# EAGLE board x9303 (EAGLE 9.6.2)
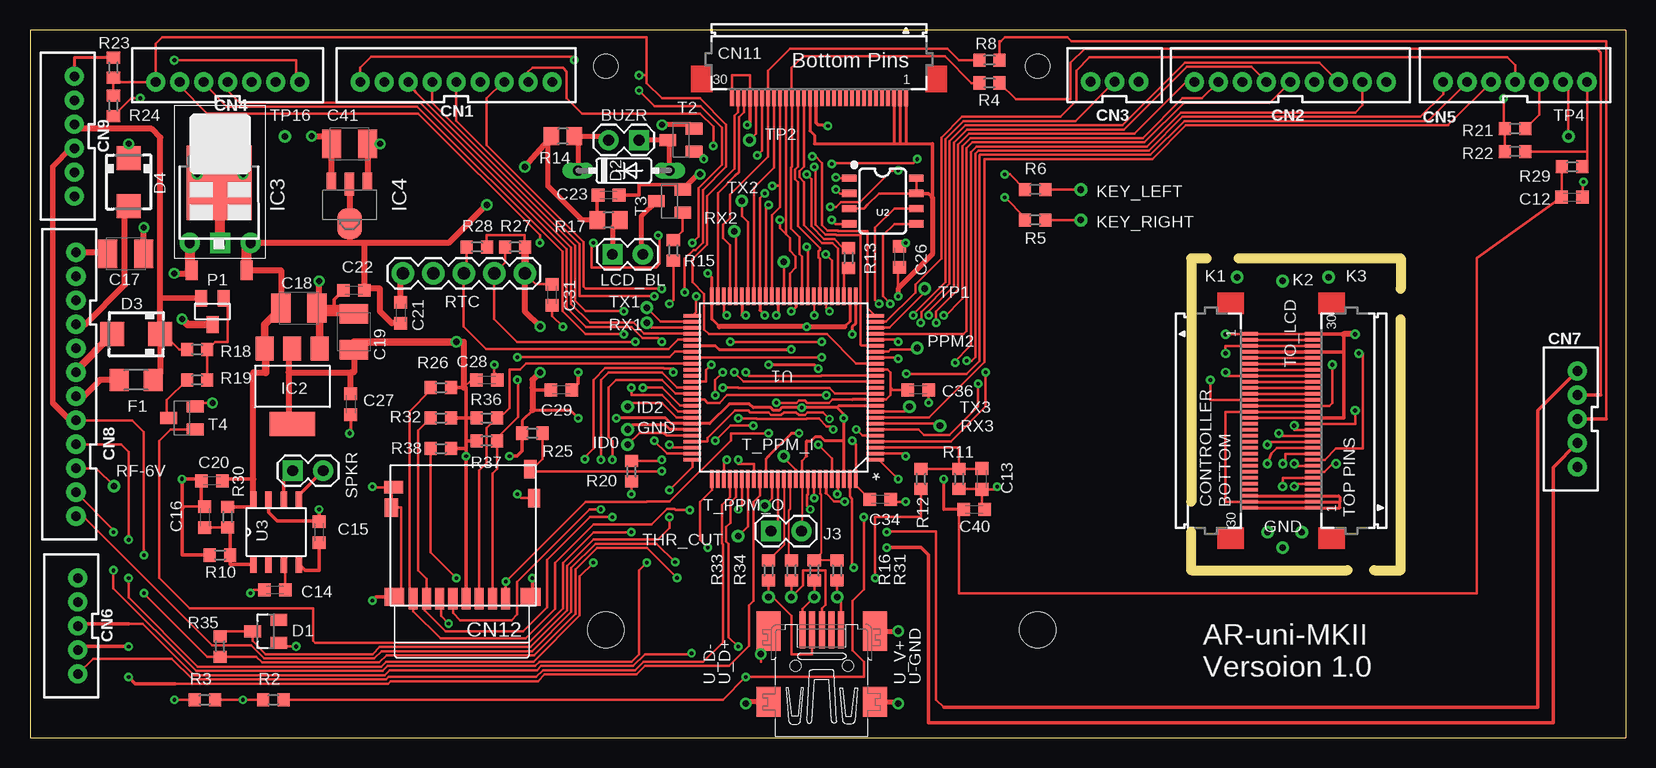
[diagram p3: board, top side]
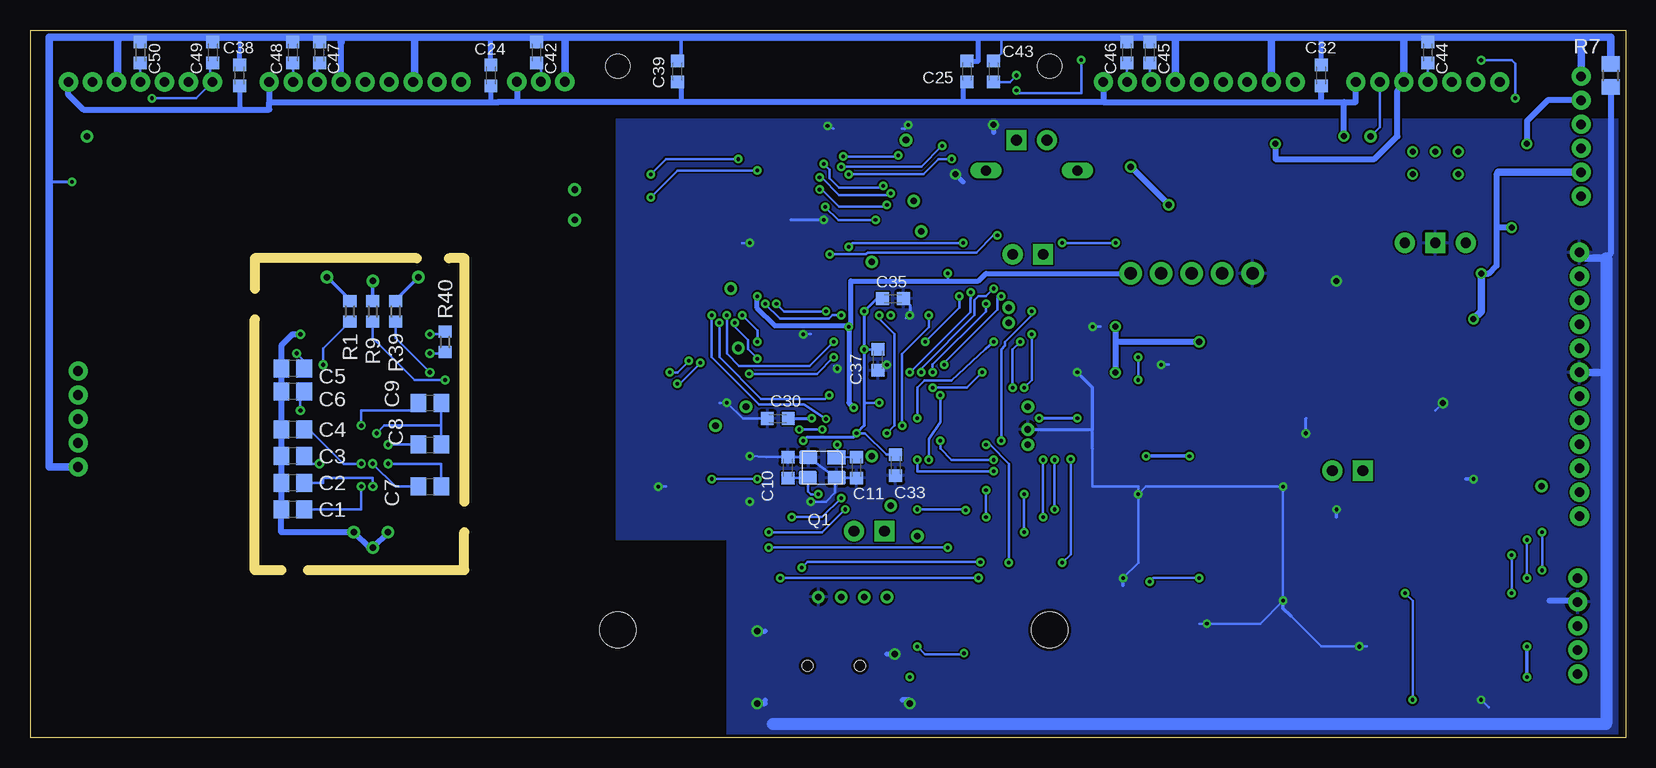
[diagram p4: board, bottom side, seen from below]

Size 133 x 59 mm. Coordinates in mm from the lower left corner, seen from the top.
Copper layers (1*16): Top 0.035mm / dielectric 1.5mm / Bottom 0.035mm
Design rules "default *": minimum track width 6mil, minimum drill 0.3mm, track to track 6mil, track to pad 6mil, pad to pad 6mil, via to via 6mil, smd to smd 6mil, copper to edge 10mil, drill to drill 6mil, minimum pad ring 10mil, minimum via ring 8mil, stop-mask expansion 4mil, vias tented up to drill 0mil, thermal gap 10mil
tKeepout: area 82,7 to 86,11; area 46,7 to 50,11; area 46,54 to 50,58; area 82,54 to 86,58
Milling: 8 lines

## Footprints (pad centres in the part's own frame; a part is rotated, then mirrored left to right if it is on the bottom)
1X02 = drill 0.9 pad 1.676 square: 1 -1.27,0 | drill 0.9 pad 1.676: 2 1.27,0
C0805 = smd 1.3 x 1.5: 1 -0.95,0; 2 0.95,0
C0603K = smd 1.05 x 1.08: 1 -0.875,0; 2 0.875,0
SMC_B = smd 1.6 x 2.4: + -1.5,0; - 1.5,0
JST-9-PTH-VERT = drill 0.8 pad 1.6: 1 -8,-1.82; 2 -6,-1.82; 3 -4,-1.82; 4 -2,-1.82; 5 0,-1.82; 6 2,-1.82; 7 4,-1.82; 8 6,-1.82; 9 8,-1.82
JST-3-PTH-VERT = drill 0.8 pad 1.6: 1 -2,-0.55; 2 0,-0.55; 3 2,-0.55
JST-7-PTH-VERT = drill 0.8 pad 1.6: 1 -6,-1.82; 2 -4,-1.82; 3 -2,-1.82; 4 0,-1.82; 5 2,-1.82; 6 4,-1.82; 7 6,-1.82
JST-5-PTH-VERT = drill 0.8 pad 1.6: 1 -4,0.18; 2 -2,0.18; 3 0,0.18; 4 2,0.18; 5 4,0.18
JST-12-PTH-VERT = drill 0.8 pad 1.6: 1 -12,-3.55; 2 -10,-3.55; 3 -8,-3.55; 4 -6,-3.55; 5 -4,-3.55; 6 -2,-3.55; 7 0,-3.55; 8 2,-3.55; 9 4,-3.55; 10 6,-3.55; 11 8,-3.55; 12 10,-3.55
JST-6-PTH-VERT = drill 0.8 pad 1.6: 1 -5,-1.82; 2 -3,-1.82; 3 -1,-1.82; 4 1,-1.82; 5 3,-1.82; 6 5,-1.82
FH12-30S-0.5SH = smd 0.3 x 1.3: 1 -7.02,2.66; 2 -6.52,2.66; 3 -6.02,2.66; 4 -5.52,2.66; 5 -5.02,2.66; 6 -4.52,2.66; 7 -4.02,2.66; 8 -3.52,2.66; 9 -3.02,2.66; 10 -2.52,2.66; 11 -2.02,2.66; 12 -1.52,2.66; 13 -1.02,2.66; 14 -0.52,2.66; 15 -0.02,2.66; 16 0.48,2.66; 17 0.98,2.66; 18 1.48,2.66; 19 1.98,2.66; 20 2.48,2.66; 21 2.98,2.66; 22 3.48,2.66; 23 3.98,2.66; 24 4.48,2.66; 25 4.98,2.66; 26 5.48,2.66; 27 5.98,2.66; 28 6.48,2.66; 29 6.98,2.66; 30 7.48,2.66
CONN8_DM3D-SF_HIR = smd 0.762 x 1.803: 1 3.551,-5.271; 2 2.451,-5.271; 3 1.351,-5.271; 4 0.251,-5.271; 5 -0.849,-5.271; 6 -1.949,-5.271; 7 -3.049,-5.271; 8 -4.149,-5.271 | smd 1.549 x 1.041: 9 -5.79,4.017 | smd 1.041 x 1.549: 10 5.606,5.531 | smd 1.143 x 1.549: GND1 -5.967,2.326 | smd 1.016 x 1.549: GND2 5.914,3.117 | smd 1.651 x 1.499: GND3 -5.732,-5.118; GND4 5.625,-5.118
SOT23 = smd 1 x 1.4: 1 -0.95,-1.1; 2 0.95,-1.1; 3 0,1.1
DO35-7 = drill 0.813 long: A 3.81,0; C -3.81,0
SMA = smd 2 x 2: A 2,0; C -2,0
R1206 = smd 1.6 x 1.803: 1 -1.422,0; 2 1.422,0
TP = drill 0.55: P$1 0,0
TO252 = smd 1 x 1.6: 1 -2.28,-4.8; 2 2.28,-4.8 | smd 5.4 x 6.2: 3 0,2.5
SOT223 = smd 1.499 x 2.007: 1 -2.261,-3.15; 2 0.025,-3.15; 3 2.311,-3.15 | smd 3.81 x 2.007: 4 0,3.15
POLOLU = drill 0.85 pad 1.676: 1 -2.54,0; 3 2.54,0 | drill 0.85 pad 1.676 square: 2 0,0
SOT89 = smd 0.8 x 1.4: 1 -1.499,-1.981; 3 1.499,-1.981 | smd 0.8 x 1.9: 2 0,-1.727 | smd 2.032 x 2.54: 4 0,1.575
XTAL2.4X2.7 = smd 1.5 x 1.15: P$1 1.2,0.85; P$2 -1.15,0.85; P$3 -1.2,-0.85; P$4 1.2,-0.85
R0603 = smd 1 x 1.1: 1 -0.85,0; 2 0.85,0
R0805 = smd 1.3 x 1.5: 1 -0.95,0; 2 0.95,0
1X05 = drill 1.016 pad 1.88: 1 0,0; 2 2.54,0; 3 5.08,0; 4 7.62,0; 5 10.16,0
SOT23-BEC = smd 1 x 1.4: B -0.95,-1.1; C 0,1.1; E 0.95,-1.1
TQFP100_14X14MC_MCH = smd 1.473 x 0.279: 1 -7.62,6; 2 -7.62,5.5; 3 -7.62,5; 4 -7.62,4.5; 5 -7.62,4; 6 -7.62,3.5; 7 -7.62,3; 8 -7.62,2.5; 9 -7.62,2; 10 -7.62,1.5; 11 -7.62,1; 12 -7.62,0.5; 13 -7.62,0; 14 -7.62,-0.5; 15 -7.62,-1; 16 -7.62,-1.5; 17 -7.62,-2; 18 -7.62,-2.5; 19 -7.62,-3; 20 -7.62,-3.5; 21 -7.62,-4; 22 -7.62,-4.5; 23 -7.62,-5; 24 -7.62,-5.5; 25 -7.62,-6; 51 7.62,-6; 52 7.62,-5.5; 53 7.62,-5; 54 7.62,-4.5; 55 7.62,-4; 56 7.62,-3.5; 57 7.62,-3; 58 7.62,-2.5; 59 7.62,-2; 60 7.62,-1.5; 61 7.62,-1; 62 7.62,-0.5; 63 7.62,0; 64 7.62,0.5; 65 7.62,1; 66 7.62,1.5; 67 7.62,2; 68 7.62,2.5; 69 7.62,3; 70 7.62,3.5; 71 7.62,4; 72 7.62,4.5; 73 7.62,5; 74 7.62,5.5; 75 7.62,6 | smd 0.279 x 1.473: 26 -6,-7.62; 27 -5.5,-7.62; 28 -5,-7.62; 29 -4.5,-7.62; 30 -4,-7.62; 31 -3.5,-7.62; 32 -3,-7.62; 33 -2.5,-7.62; 34 -2,-7.62; 35 -1.5,-7.62; 36 -1,-7.62; 37 -0.5,-7.62; 38 0,-7.62; 39 0.5,-7.62; 40 1,-7.62; 41 1.5,-7.62; 42 2,-7.62; 43 2.5,-7.62; 44 3,-7.62; 45 3.5,-7.62; 46 4,-7.62; 47 4.5,-7.62; 48 5,-7.62; 49 5.5,-7.62; 50 6,-7.62; 76 6,7.62; 77 5.5,7.62; 78 5,7.62; 79 4.5,7.62; 80 4,7.62; 81 3.5,7.62; 82 3,7.62; 83 2.5,7.62; 84 2,7.62; 85 1.5,7.62; 86 1,7.62; 87 0.5,7.62; 88 0,7.62; 89 -0.5,7.62; 90 -1,7.62; 91 -1.5,7.62; 92 -2,7.62; 93 -2.5,7.62; 94 -3,7.62; 95 -3.5,7.62; 96 -4,7.62; 97 -4.5,7.62; 98 -5,7.62; 99 -5.5,7.62; 100 -6,7.62
SO08 = smd 1.2 x 0.6: 1 -2.8,1.905; 2 -2.8,0.635; 3 -2.8,-0.635; 4 -2.8,-1.905; 5 2.8,-1.905; 6 2.8,-0.635; 7 2.8,0.635; 8 2.8,1.905
SOIC_2AADCR_DIO = smd 1.422 x 0.559: 1 -2.692,1.905; 2 -2.692,0.635; 3 -2.692,-0.635; 4 -2.692,-1.905; 5 2.692,-1.905; 6 2.692,-0.635; 7 2.692,0.635; 8 2.692,1.905
XR9303-PCB_OUTLINE = hole 2: 62,56; 98,56 | hole 3: 98,9; 62,9
32005-201 = smd 3.1 x 0.5: 1_VBUS 3,1.6; 2_D- 3,0.8; 3_D+ 3,0; 4_ID 3,-0.8; 5_USB_GND 3,-1.6 | smd 2.5 x 2: M1 -3,-4.45; M2 -3,4.45 | smd 3.3 x 2: M3 2.9,4.45; M4 2.9,-4.45 | hole 0.9: 0,2.2; 0,-2.2

## Placement (x,y rotation side)
BUZR  HAPTIC  [1X02]  49.5,49.85 180 top
C1  1uF  [C0805]  111.09,19.05 180 bottom
C2  1uF  [C0805]  111.09,21.27 180 bottom
C3  1uF  [C0805]  111.09,23.5 180 bottom
C4  1uF  [C0805]  111.09,25.72 180 bottom
C5  1uF  [C0805]  111.09,30.8 180 bottom
C6  1uF  [C0805]  111.09,28.89 180 bottom
C7  1uF  [C0805]  99.67,20.95 0 bottom
C8  1uF  [C0805]  99.67,24.45 0 bottom
C9  1uF  [C0805]  99.67,27.94 0 bottom
C10  18pf  [C0603K]  69.82,22.54 270 bottom
C11  18pf  [C0603K]  64.11,22.54 90 bottom
C12  1uF  [C0603K]  128.56,45.09 0 top
C13  0.1uF  [C0603K]  79.34,21.59 90 top
C14  0.1uF  [C0603K]  20.4,12.35 0 top
C15  0.1uF  [C0603K]  24.1,17.14 270 top
C16  1uF  [C0603K]  14.57,18.41 90 top
C17  22uf/16V  [SMC_B]  7.98,40.37 180 top
C18  33uf/10V  [SMC_B]  22.42,35.84 0 top
C19  33uf/10V  [SMC_B]  27,33.87 90 top
C20  0.1uF  [C0603K]  15.16,21.43 0 top
C21  0.1uF  [C0603K]  30.91,35.45 270 top
C22  0.1uF  [C0603K]  27.01,37.32 0 top
C23  0.1uF  [C0603K]  48.23,45.26 180 top
C24  0.1uF  [C0603K]  94.58,55.24 270 bottom
C25  0.1uF  [C0603K]  54.9,55.56 270 bottom
C26  0.1uF  [C0603K]  72.47,40.11 270 top
C27  0.1uF  [C0603K]  26.74,27.81 90 top
C28  0.1uF  [C0603K]  38.07,29.84 180 top
C29  0.1uF  [C0603K]  44.29,29.02 180 top
C30  0.1uF  [C0603K]  70.67,26.62 0 bottom
C31  0.1uF  [C0603K]  43.52,36.96 90 top
C32  0.1uF  [C0603K]  25.37,55.24 270 bottom
C33  0.1uF  [C0603K]  60.84,22.74 90 bottom
C34  0.1uF  [C0603K]  70.88,19.89 180 top
C35  0.1uF  [C0603K]  61.06,36.62 180 bottom
C36  0.1uF  [C0603K]  74.06,29.02 180 top
C37  0.1uF  [C0603K]  62.33,31.52 90 bottom
C38  0.1uF  [C0603K]  115.54,55.24 270 bottom
C39  0.1uF  [C0603K]  79.03,55.56 270 bottom
C40  1uF  [C0603K]  78.71,19.05 0 top
C41  33uf/10V  [SMC_B]  26.64,49.53 0 top
C42  0.1uF  [C0603K]  90.78,57.15 270 bottom
C43  0.1uF  [C0603K]  52.67,55.56 270 bottom
C44  0.1uF  [C0603K]  16.48,57.15 270 bottom
C45  0.1uF  [C0603K]  39.66,57.15 270 bottom
C46  0.1uF  [C0603K]  41.56,57.15 270 bottom
C47  0.1uF  [C0603K]  108.87,57.15 270 bottom
C48  0.1uF  [C0603K]  111.09,57.15 270 bottom
C49  0.1uF  [C0603K]  117.76,57.15 270 bottom
C50  0.1uF  [C0603K]  123.79,57.15 270 bottom
CN1  [JST-9-PTH-VERT]  35.53,56.52 0 top
CN2  [JST-9-PTH-VERT]  105.06,56.52 0 top
CN3  [JST-3-PTH-VERT]  90.41,55.27 0 top
CN4  [JST-7-PTH-VERT]  16.48,56.52 0 top
CN5  [JST-7-PTH-VERT]  123.79,56.52 0 top
CN6  [JST-5-PTH-VERT]  4.17,9.33 90 top
CN7  [JST-5-PTH-VERT]  129.17,26.59 90 top
CN8  [JST-12-PTH-VERT]  0.29,30.48 90 top
CN9  [JST-6-PTH-VERT]  1.88,50.16 90 top
CN11  ERC12864-2  [FH12-30S-0.5SH]  66,56 180 top
CN12  SD-CARD_10P  [CONN8_DM3D-SF_HIR]  36.1,16.88 0 top
CONTROLLER  FPC30-Top_pins  [FH12-30S-0.5SH]  99.03,26.67 270 top
D1  3V  [SOT23]  19.66,8.89 90 top
D2  1N4148  [DO35-7]  49.5,47.31 0 top
D3  MURA220T3G  [SMA]  8.86,33.66 180 top
D4  MURA220T3G  [SMA]  8.23,46.35 270 top
F1  [R1206]  8.86,29.84 0 top
GND  TP-1  [TP]  49.82,25.72 0 top
IC1  7805DT  [TO252]  15.77,43.8 0 top
IC2  L1117  [SOT223]  21.88,29.31 180 top
IC3  Pololu  [POLOLU]  15.84,41.27 0 top
IC4  MCP1700T30  [SOT89]  26.64,44.45 180 top
ID0  TP-1  [TP]  49.82,24.45 180 top
ID2  TP-1  [TP]  49.82,27.62 0 top
J3  ERASE  [1X02]  63.03,17.24 0 top
K1  TP-1  [TP]  100.62,38.42 0 top
K2  TP-1  [TP]  104.43,38.1 0 top
K3  TP-1  [TP]  108.24,38.42 0 top
K_EXT4  TP-1  [TP]  103.16,17.14 0 top
K_EXT5  TP-1  [TP]  104.43,15.88 0 top
K_EXT6  TP-1  [TP]  106.02,17.14 0 top
KEY_LEFT  TP-1  [TP]  87.6,45.72 0 top
KEY_RIGHT  TP-1  [TP]  87.6,43.18 0 top
LCD_BL  LCD_BL  [1X02]  49.82,40.32 0 top
P1  SI2371  [SOT23]  15.21,35.56 180 top
PA25  TP-1  [TP]  62.83,39.69 0 top
PPM2  TP-1  [TP]  73.95,32.51 0 top
Q1  12MHZ  [XTAL2.4X2.7]  66.96,22.54 0 bottom
R1  2.7K  [R0603]  106.33,35.56 90 bottom
R2  1K  [R0603]  20.29,3.17 180 top
R3  1K  [R0603]  14.57,3.17 0 top
R4  2.7K  [R0603]  79.98,54.61 0 top
R5  2.7K  [R0603]  83.79,43.18 0 top
R6  2.7K  [R0603]  83.79,45.72 0 top
R7  0  [R0805]  1.24,55.24 90 bottom
R8  2.7K  [R0603]  79.98,56.52 0 top
R9  2.7K  [R0603]  104.43,35.56 90 bottom
R10  470K  [R0603]  15.84,15.24 0 top
R11  2.7K  [R0603]  77.44,21.59 90 top
R12  10K  [R0603]  74.27,21.59 270 top
R13  1K  [R0603]  68.23,40.01 270 top
R14  12  [R0805]  44.42,50.16 180 top
R15  1K  [R0603]  53.63,40.64 90 top
R16  33k  [R0603]  65.38,13.97 270 top
R17  150  [R0805]  48.23,43.18 180 top
R18  100K  [R0603]  13.94,32.38 180 top
R19  2.7K  [R0603]  13.94,29.84 180 top
R20  1K  [R0603]  50.14,22.23 90 top
R21  33k  [R0603]  123.79,50.8 180 top
R22  33k  [R0603]  123.79,48.9 0 top
R23  33k  [R0603]  6.95,55.88 270 top
R24  33k  [R0603]  6.95,52.7 270 top
R25  33k  [R0603]  41.88,25.4 180 top
R26  33k  [R0603]  34.26,29.21 0 top
R27  2.7K  [R0603]  40.44,40.94 0 top
R28  2.7K  [R0603]  37.26,40.94 0 top
R29  120  [R0603]  128.56,47.62 180 top
R30  10K  [R0603]  16.48,18.41 90 top
R31  47K  [R0603]  67.28,13.97 90 top
R32  33k  [R0603]  34.26,26.67 0 top
R33  120  [R0603]  61.56,13.97 270 top
R34  120  [R0603]  63.47,13.97 270 top
R35  10K  [R0603]  15.84,7.62 90 top
R36  33k  [R0603]  38.07,26.67 180 top
R37  33k  [R0603]  38.07,24.77 180 top
R38  33k  [R0603]  34.26,24.13 0 top
R39  2.7K  [R0603]  102.52,35.56 90 bottom
R40  10K  [R0603]  98.39,33.02 270 bottom
RF-6V  TP-1  [TP]  7,21 0 top
RTC  [1X05]  41.24,38.73 180 top
RX1  TP-1  [TP]  51.41,34.61 0 top
RX2  TP-1  [TP]  58.71,42.23 0 top
RX3  TP-1  [TP]  75.85,26.04 0 top
SPKR  SKPR  [1X02]  23.17,22.28 0 top
T2  MMBT3904  [SOT23-BEC]  54.26,49.85 90 top
T3  MMBT3904  [SOT23-BEC]  53.31,44.77 90 top
T4  MMBT3904  [SOT23-BEC]  12.67,26.67 90 top
T_PPM_I  TP-1  [TP]  62.83,23.5 0 top
T_PPM_O  TP-1  [TP]  61.25,19.37 0 top
THR_CUT  TP-1  [TP]  59.03,16.83 0 top
TO_LCD  ERC12864-2  [FH12-30S-0.5SH]  109.57,26.21 90 top
TP1  TP-1  [TP]  74.58,37.47 0 top
TP2  TP-1  [TP]  59.98,49.85 0 top
TP4  TP-1  [TP]  128.24,50.16 0 top
TP16  TP-1  [TP]  21.24,50.16 0 top
TX1  TP-1  [TP]  51.41,35.88 0 top
TX2  TP-1  [TP]  59.34,44.77 0 top
TX3  TP-1  [TP]  73.31,27.62 0 top
U1  ATSAM4S16CA-ANR  [TQFP100_14X14MC_MCH]  62.83,29.21 180 top
U2  AT25SF041SOIC-NARROW  [SO08]  71.09,44.77 0 top
U3  PAM8302A  [SOIC_2AADCR_DIO]  20.52,17.16 90 top
U$1  XR9303-PCB  [XR9303-PCB_OUTLINE]  -14,0 0 top
U-GND  TP-1  [TP]  67.28,11.75 0 top
U_D+  TP-1  [TP]  63.47,11.75 0 top
U_D-  TP-1  [TP]  61.56,11.75 0 top
U_V+  TP-1  [TP]  65.38,11.75 0 top
X2  [32005-201]  66,6 90 top

## Tracks (layer width: path | path; a pad name or v marks a point on that pad's centre or on a via)
1V8  (via drill 0.3)
  Top 0.2: 71.72,29.21 71.72,30.48 71.5,30.71 U1.16 | 71.72,29.21 71.72,28.57 71.36,28.21 U1.11 | 68.55,28.21 66.88,28.21 66.61,27.94 64.78,27.94 64.59,28.14 64.08,28.14 63.89,27.94 v62.2,27.94 | v68.55,24.77 68.83,24.48 | U1.100 68.83,21.07 C34.2 | C36.2 71.91,29.02 71.72,29.21
  Top 0.203: 68.83,24.48 U1.100 | U1.85 61.33,23.27 61.56,23.5
  Top 0.254: U1.11 68.55,28.21 | v64.11,25.4 63.47,25.4 61.56,23.5 | U1.56 57.11,32.71 57.44,32.38 v63.47,32.38 | U1.36 63.83,35.92 v63.47,35.56
  Bottom 0.2: v62.2,27.94 63.47,27.94 | 62.41,36.62 C35.2 | v64.11,25.4 63.4,25.4 61.62,23.62 C33.2
  Bottom 0.203: v63.47,32.38 v63.47,32.39 C37.2
  Bottom 0.254: v68.55,24.77 68.23,25.08 64.34,25.08 v64.11,25.4 63.47,26.04 63.47,27.94 v63.47,32.38 v63.47,35.56 62.41,36.62
+3V0-ANA  (via drill 0.35, 0.5)
  Top 0.203: R24.2 8.44,53.34 v9.18,53.34 | v12.04,56.52 22.2,56.52 22.2,54.98 CN4.7 | CN5.7 129.79,48.9 | 129.79,48.9 129.79,48.01 R29.1 | R22.2 129.79,48.9
  Top 0.508: IC4.3 C41.+ 24.51,50.16 v23.47,50.16
  Bottom 0.203: v9.18,53.34 9.18,56.2 9.5,56.52 v12.04,56.52
  Bottom 0.406: C25.2 55.22,54.37 55.22,53.02 | C39.2 78.71,54.69 78.71,53.02 | C38.2 115.54,52.39 | C24.2 94.58,53.02 93.95,53.02
  Bottom 0.508: CN5.7 129.79,53.62 128.56,52.39 115.54,52.39 113.06,52.39 113.06,53.02 | 43.53,53.02 55.22,53.02 78.71,53.02 92.41,53.02 | 92.41,53.02 93.95,53.02 113.06,53.02 | CN2.9 113.06,53.02 | CN3.3 92.41,53.02 | CN1.9 43.53,53.02 | CN4.7 22.48,53.02 23.47,53.02 | 43.53,53.02 25.37,53.02 | 25.37,53.02 23.47,53.02 | 25.37,53.02 C32.2 | v23.47,50.16 23.47,53.02
+3V3  (via drill 0.3, 0.5, 0.55)
  Top 0.152: U1.91 64.33,17.27 J3.2
  Top 0.2: v64.33,27.53 62.65,27.53 62.45,27.33 61.95,27.33 61.75,27.53 60.3,27.53 | U2.3 69.5,44.13 | 69.82,44.45 70.77,45.4 U2.7 U2.8 | C28.2 36.8,29.84 36.16,29.21 | C31.2 42.15,37.84 RTC.1 | R27.2 41.24,40.98 41.24,41.91 38.07,41.91 38.07,40.98 R28.2
  Top 0.203: U1.91 64.33,23.09 64.74,23.5 | C26.2 72.36,39.13 72.36,37.47 | 69.5,44.13 69.82,44.45
  Top 0.254: 67.83,24.77 67.83,26.66 | 67.28,27.53 v64.33,27.53 62.69,27.53 62.46,27.31 61.94,27.31 61.72,27.53 60.3,27.53 59.98,27.85 58.3,27.85 56.66,26.21 U1.69 53.45,26.21 52.99,26.67 v48.87,26.67 | 67.83,24.77 66.27,24.77 65.95,25.08 65.43,25.08 65.11,24.77 64.74,24.77 64.74,23.5 | U1.27 68.33,34.71 67.92,34.29 | 57.47,34.29 56.83,34.92 U1.50 56.83,38.38 v56.48,38.73 | v45.69,26.67 45.05,27.3 41.88,27.3 41.03,26.45 R25.2 | U1.98 67.83,24.77 | CN11.17 65.02,50.62 65.38,50.26 65.38,49.53 72.02,49.53 | v67.85,26.65 67.83,26.66 | 72.52,49.53 73.02,49.53 | 73.02,49.53 75.22,49.53 | CN11.1 73.02,49.53 | CN11.2 72.52,49.53 | CN11.3 72.02,49.53 | 72.02,49.53 72.52,49.53 | 67.28,27.53 67.83,26.98 67.83,26.66 | 67.28,27.53 67.46,27.71 U1.10
  Top 0.305: CN12.4 v36.35,23.5 36.35,24.13 | 36.35,24.13 36.35,24.77 | 36.35,24.77 36.35,26.67 | 36.35,26.67 36.35,29.21 36.16,29.21 R26.2 | R36.2 36.35,26.67 | R37.2 36.35,24.77 | R32.2 36.35,26.67 | R38.2 36.35,24.13 | R25.2 41.03,23.91 40.61,23.5 v39.98,23.5 | C29.2 42.06,29.02 41.88,29.21 | U2.7 74.9,45.4 75.22,45.09 75.22,49.53
  Top 0.406: 57.47,34.29 v64.74,34.29 67.92,34.29 | 75.22,45.09 75.22,40.32 72.36,37.47 v72.36,36.83
  Top 0.508: RTC.1 41.24,35.56 v42.52,34.29 | v42.52,30.48 41.88,29.84 41.88,29.21 41.88,27.3 | 21.56,30.48 21.56,32.16 IC2.2 | 21.56,30.48 21.56,26.48 IC2.4 | 21.56,30.48 26.74,30.48 | 26.74,30.48 27,30.48 C19.+ | C27.2 26.74,30.48 | 36.16,29.21 36.16,33.02 v35.53,33.02
  Top 0.61: R27.2 41.28,38.77 RTC.1 | v35.53,33.02 27,33.02 C19.+
  Bottom 0.2: v56.48,38.73 56.48,38.1
  Bottom 0.254: v48.87,26.67 v45.69,26.67 | C30.2 67.97,26.62 67.92,26.67 67.87,26.67 v67.85,26.65
  Bottom 0.305: v39.98,23.5 v36.35,23.5
  Bottom 0.406: v64.74,34.29 64.74,27.93 v64.33,27.53 | v72.36,36.83 72.36,36.56 72.43,36.49 72.43,35.9 70.9,34.36 64.81,34.36 v64.74,34.29 | v64.74,34.29 64.74,34.43 64.56,34.43 64.56,38.1 56.48,38.1 53.94,38.1 53.31,38.73 RTC.1
  Bottom 0.508: v42.52,34.29 42.52,33.02 | 42.52,33.02 v42.52,30.48 | v35.53,33.02 42.52,33.02
+5V  (via drill 0.55)
  Top 0.203: R14.2 43.15,49.53
  Top 0.305: R17.2 47.28,45.26 C23.2 | C20.2 16.04,21.59 18.62,21.59 | R30.2 18.62,19.27 U3.8
  Top 0.406: R17.2 46.01,43.18 43.15,46.04 43.15,49.53
  Top 0.508: 18.05,38.73 IC1.2 20.92,38.99 C18.+ | U3.8 18.62,21.59 18.62,30.48 19.66,30.48 | 27.91,41.27 34.9,41.27 v38.07,44.45 | 27.91,41.27 26.64,41.27 | 26.64,41.27 IC3.3 | 27.91,41.27 27.88,41.24 C22.2 28.02,37.47 29.18,37.47 29.18,35.56 30.16,34.58 C21.2 | IC4.2 IC4.4 26.64,41.27 | v41.24,47.62 R14.2
  Top 0.61: IC2.3 19.57,33.02 | 19.57,33.02 19.57,34.48 C18.+ | 19.66,30.48 19.66,32.93 19.57,33.02
  Top 0.813: IC3.3 18.05,40.94 18.05,38.73
  Bottom 0.508: v41.24,47.62 v38.07,44.45
AGND  (via drill 0.3, 0.5)
  Top 0.2: R21.1 125.79,51.95 CN5.5
  Top 0.203: C12.2 129.43,46.28 v129.51,46.35
  Top 0.254: R23.1 3.7,56.73 CN9.6
  Top 0.508: IC4.1 C41.- v29.18,49.53
  Bottom 0.203: C43.1 52.04,57.07 52.04,58.42 | C44.1 16.88,58.42 17.43,58.42 | C45.1 39.34,58.34 37.83,58.34 37.75,58.42
  Bottom 0.254: v129.51,46.35 131.41,46.35
  Bottom 0.305: C42.1 90.78,58.42 91.41,58.42 | 94.58,58.24 94.58,58.42 95.22,58.42 | C47.1 108.87,58.42 107.92,58.42 | C48.1 111.09,58.42 111.73,58.42 | 115.54,57.15 115.54,58.42 | C49.1 117.76,58.42 118.08,58.42 | C50.1 123.79,58.42 124.43,58.42 | 88.41,58.24 88.41,58.42 87.6,58.42 | C39.1 78.71,56.44 78.71,58.42
  Bottom 0.406: C24.1 94.58,58.24 | C32.1 25.37,58.42 | C25.1 53.94,56.44 53.94,58.42 | C38.1 115.54,57.15
  Bottom 0.508: CN2.6 107.06,58.02 | CN4.5 18.48,54.52 19.02,53.98 19.02,50.16 20.92,48.26 29.18,48.26 v29.18,49.53
  Bottom 0.61: CN7.1 131.41,22.59 131.41,46.35 131.41,58.42 125.7,58.42 | 3.7,58.42 CN9.6 | 41.96,58.42 52.04,58.42 53.94,58.42 78.71,58.42 87.6,58.42 91.41,58.42 95.22,58.42 100.94,58.42 | 41.96,58.42 C46.1 | 41.96,58.42 37.75,58.42 37.53,58.42 | 37.53,58.42 29.53,58.42 | 29.53,58.42 25.37,58.42 18.48,58.42 | 18.48,58.42 17.43,58.42 3.7,58.42 | CN4.5 18.48,58.42 | CN1.2 29.53,58.42 | CN1.6 37.53,58.42 | CN2.3 100.94,54.7 100.94,58.42 | CN5.5 125.7,54.7 125.7,58.42 | CN3.1 88.41,58.24 | R7.2 1.24,58.42 3.7,58.42 | 100.94,58.42 107.06,58.42 | 107.06,58.42 107.92,58.42 111.73,58.42 115.54,58.42 118.08,58.42 124.43,58.42 125.7,58.42 | 107.06,58.02 107.06,58.42
AIL_DR  (via drill 0.3)
  Top 0.2: CN4.3 14.48,54.57 16.42,52.63 32.29,52.63 44.39,40.53 44.39,35.59 46.33,33.66 v49.5,33.66 | U1.67 54.04,27.21 52.67,28.57 50.14,28.57 v50.14,29.21
  Bottom 0.2: v50.14,29.21 49.5,29.84 v49.5,33.66
AUDIO  (via drill 0.3)
  Top 0.2: U1.93 65.33,20.04 v65.38,20 | v69.5,18.41 69.5,12.7 | 57.75,3.17 v59.66,5.08
  Top 0.203: R2.1 57.75,3.17 | 69.5,12.7 69.5,12.38 68.55,11.43 68.55,7.3 69.5,6.35 69.5,5.08 v59.66,5.08
  Bottom 0.2: v65.38,20 66.96,18.41 v69.5,18.41
AUX2-SW-3WAY  (via drill 0.3, 0.35)
  Top 0.2: R24.1 R23.2 7.29,54.7 CN4.1 10.48,57.87 11.03,58.42 51.41,58.42 51.41,55.24 51.41,54.61 52.67,53.34 55.85,53.34 58.04,51.15 58.04,47.64 56.09,45.69 56.09,41.29 55.47,40.67 55.3,40.67 54.58,39.95 v54.58,37.15 | U1.15 65.96,30.21 65.94,30.19 59.95,30.19 v59.66,30.48
  Top 0.203: v50.77,55.24 51.41,55.24
  Bottom 0.2: v54.58,37.15 54.58,36.69 54.61,36.66 54.61,35.52 v59.66,30.48
  Bottom 0.203: C43.2 51.33,54.69 v50.77,55.24
AUX4_SW  (via drill 0.3)
  Top 0.2: CN4.2 12.48,54.38 14.79,52.07 32.35,52.07 42.52,41.91 v42.52,41.27 | U1.30 66.83,39.81 v66.33,40.32 | v46.96,41.27 46.82,41.14 46.82,39.23 52.17,39.23 52.5,39.55 52.5,41.77 v52.36,41.91
  Bottom 0.2: v42.52,41.27 v46.96,41.27 | v52.36,41.91 52.67,41.91 54.12,40.47 63.16,40.47 63.31,40.32 v66.33,40.32
AUX_TRM-3WAY
  Bottom 0.2: CN4.6 20.48,50.93 TP16.P$1
BTN_EXIT  (via drill 0.3)
  Top 0.2: U1.92 64.83,20.32 64.77,20.25 64.77,19.34 v65.06,19.05
  Top 0.203: v71.41,17.14 71.5,17.23 75.53,17.23 75.53,3.17 76.17,2.54
  Top 0.305: CN7.5 125.7,27.3 125.7,2.54 76.17,2.54
  Bottom 0.2: v65.06,19.05 66.96,17.14 v71.41,17.14
BTN_MENU  (via drill 0.3)
  Top 0.2: v56.48,15.88 55.85,16.51 55.85,19.68 56.83,20.67 U1.76
  Top 0.305: CN7.2 126.97,22.57 126.97,1.27 74.9,1.27 74.9,15.24 74.27,15.88 v71.41,15.88
  Bottom 0.2: v56.48,15.88 v71.41,15.88
CHARGER+
  Top 0.508: CN8.9 4.61,34.48 7.91,37.78 7.91,44.04 D4.A
CHIP_ERASE
  Top 0.2: U1.87 62.33,17.38 J3.1
ELEV_DR
  Top 0.2: U1.8 71.72,26.71 74.93,26.71 79.55,31.33 79.55,48.26 93.54,48.26 96.36,51.08 118.24,51.08 118.24,51.14 CN5.3
FLAP-SW-3WAY  (via drill 0.3)
  Top 0.2: v122.84,53.34 122.84,51.22 122.94,51.12 R21.2 R22.1 | U1.4 76.75,24.71 79.66,27.62 v79.66,30.48 | CN5.1 117.79,53.69 115.89,51.79 96.07,51.79 93.25,48.97 79.06,48.97 78.8,48.72 78.8,31.75 78.49,31.43 v78.08,31.43
  Bottom 0.2: v122.84,53.34 119.15,53.34 117.98,54.51 CN5.1 | v79.66,30.48 79.03,30.48 v78.08,31.43
  Bottom 0.203: C49.2 117.98,56.06 117.98,54.51
FLASH_CS  (via drill 0.3)
  Top 0.2: v61.25,45.4 60.83,44.99 U1.42 | U2.1 67.25,46.67 v67.19,46.74
  Top 0.254: U1.42 60.83,35.66 v61.25,35.24
  Bottom 0.2: v67.19,46.74 67.03,46.74 65.56,45.27 61.38,45.27 v61.25,45.4
GEAR_SW  (via drill 0.3)
  Top 0.2: CN8.2 6.95,17.36 v6.95,17.14 | v6.95,13.97 6.95,12.47 13.85,5.58 29.4,5.58 29.82,6 42.11,6 42.47,6.35 50.14,6.35 50.77,6.99 50.77,13.97 v51.41,14.61 | U1.73 53.55,24.21 v53.31,24.45
  Bottom 0.2: v6.95,17.14 v6.95,13.97 | v51.41,14.61 51.41,22.86 52.99,24.45 v53.31,24.45
GND  (via drill 0.3, 0.35, 0.5, 0.55)
  Top 0.2: R31.1 U-GND.P$1 67.6,11.43 X2.5_USB_GND | v67.92,19.68 67.89,19.71 67.03,19.71 66.33,20.41 | C13.1 79.32,20.74 R11.1 77.44,20.64 | CN12.6 34.26,11.49 34.26,10.16 v34.9,9.53 | CN12.GND3 30.95,12.33 30.95,19.2 CN12.GND1 30.13,20.57 29.81,20.89 | v60.93,6.99 60.93,6.35 | CN12.9 29.81,20.89 | 29.81,20.89 28.61,20.89 v28.55,20.95 | CN12.GND2 40.94,19.99 v40.61,20.32 | T4.E 14.09,27.94 v15.21,27.94 | C34.1 71.97,19.68 v73,19.68 | C26.1 72.36,41.35 | C28.1 38.95,30.24 38.7,30.48 v38.7,31.11 | C36.1 74.9,28.99 v74.9,27.94 | 59.33,35.25 59.34,35.24 | 16.48,46.35 16.15,46.68 | C31.1 43.52,35.19 v44.42,34.29 | 72.78,23.71 v73,23.5 | U2.4 67.14,42.86 v66.82,43.19
  Top 0.203: D1.1 21.08,7.62 v22.2,7.62 | v73,41.27 72.75,41.27 C26.1 | R3.1 v12.04,3.17 | CN11.30 58.52,55.24 60.02,55.24 CN11.27 | C16.2 12.91,19.29 12.67,19.05 | C40.2 79.34,19.29 C13.1 80.38,20.71 v80.61,20.95 | U1.2 72.78,23.71
  Top 0.254: U1.95 66.33,20.41 | U1.70 53.36,25.71 52.97,26.11 50.2,26.11 GND.P$1 | v61.56,31.11 65.38,31.11 v65.69,30.8 | U1.45 59.33,35.25 | 59.34,35.24 v59.66,35.24 | U1.26 68.83,34.57 68.55,34.28 v68.55,33.66 | C27.1 26.74,25.4 v26.64,25.4 | 60.02,51.36 v59.78,51.12
  Top 0.305: U3.7 19.88,18.82 20.61,18.1 24.02,18.1 C15.1 v24.1,19.05 | v28.55,11.43 28.87,11.76 CN12.GND3 | CN12.GND4 41.88,11.91 v41.88,13.34 | C23.1 50.77,45.26 50.77,46.12 54.81,46.12 | C22.1 25.37,36.56 25.37,35.84 | C29.1 45.69,29.55 v45.69,30.48 | CN11.16 65.52,51.29 65.69,51.12 v66.52,51.04 | C16.2 14.29,19.36 C20.1 14.29,21.59 v12.67,21.59 12.67,19.05 12.67,15.24 R10.1 | CN11.27 60.02,51.36
  Top 0.406: X2.M4 v72.35,8.9 v72.36,8.89 | X2.M3 60.93,8.28 v60.93,6.99 | X2.M2 59.66,3 v59.66,2.86 | X2.M1 72.36,3 v72.36,2.86 | T3.E 54.81,46.12 55.68,46.99 v55.85,46.99 | T2.E 55.04,51.12 v52.67,51.12
  Top 0.508: 26.53,35.84 25.37,35.84 C18.- | C18.- 24.1,36.02 v24.1,38.1 | C17.- 6.37,40.48 CN8.12 | C21.1 30.91,38.56 RTC.5 | C19.- 24.39,35.37 C18.-
  Top 0.61: IC2.1 24.14,35.61 C18.- | CN8.7 3.84,30.63 D3.A | 16.15,46.68 IC1.3
  Top 0.813: 16.15,46.68 15.84,46.38 IC3.2
  Bottom 0.2: v68.55,33.66 67.92,33.66 | Q1.P$4 65.37,21.69 | 65.37,21.69 C11.1 | Q1.P$4 65.88,21.77 | 65.88,21.77 Q1.P$2 C10.1 71.65,23.42 v73,23.5 | 67.89,19.71 v67.92,19.68 | 65.88,20.95 65.88,21.77 | Q1.P$4 65.37,21.69 | 35.53,9.53 v34.9,9.53 30.45,9.53 v28.55,11.43 v28.55,20.95 39.98,20.95 v40.61,20.32 | v40.61,20.32 40.61,20.95 44.42,20.95 44.42,24.13 | v15.21,27.94 15.84,27.3 | v41.88,13.34 40.61,14.61 v40.61,20.32 | v22.2,7.62 25.37,7.62 27.91,10.16 | C33.1 60.84,21.43 | v38.7,31.11 38.07,31.11 | 75.53,27.94 v74.9,27.94 73.58,26.62 C30.1 | v65.69,30.8 65.89,31 66,31 | v59.66,35.24 59.76,35.24 60,35 | v66.52,51.04 66.01,50.8 | v44.42,34.29 43.78,34.29 | 60.3,50.8 60.1,50.8
  Bottom 0.203: v22.2,7.62 21.56,7.62 | v73,41.27 73.63,41.27 | v12.04,3.17 11.4,2.54 | 65.88,20.95 65.88,20.45 66.64,19.68 67.86,19.68 67.89,19.71 | v80.61,20.95 79.98,20.95
  Bottom 0.254: v66.82,43.19 69.57,43.18 | GND.P$1 44.42,25.72 | C37.1 61.86,31.11 v61.56,31.11 | C35.1 59.66,36.09 v59.66,35.24 | 44.42,24.13 44.42,26.04 | v26.64,25.4 26.64,26.67 | v59.78,51.12 60.1,50.8
  Bottom 0.305: 27.91,10.16 28.55,10.79 v28.55,11.43 | v41.88,13.34 41.88,12.7 | v45.69,30.48 44.42,29.21 44.42,26.04 44.42,25.72 | v24.1,19.05 24.1,18.41 | v12.67,21.59 13.3,21.59
  Bottom 0.406: v60.93,6.99 61.56,6.99 | v72.36,8.89 71.72,8.89 | v59.66,2.86 59.66,3.17 60.3,3.17 | v72.36,2.86 71.72,2.86 71.72,3.17 | v55.85,46.99 55.22,46.35 | v52.67,51.12 52.67,50.48
  Bottom 0.508: R7.1 1.24,40.37 1.61,40.01 | CN6.4 4.09,11.43 6.32,11.43
  Bottom 0.61: CN8.12 3.36,40.01 1.61,40.01 | CN8.7 1.61,30.48
  Bottom 1.016: 1.61,40.01 1.61,30.48 1.61,1.18 71.09,1.18
  pour Bottom: 0.63,51.65 0.63,0 74.9,0 74.9,16.51 84.11,16.51 84.11,51.65
GNDFFFF
  cutout Bottom: 95.86,13.34 114.91,13.34 114.91,40.64 95.86,40.64
HAPTIC
  Top 0.2: R13.2 67.83,39.16 U1.28
ID0
  Top 0.2: U1.71 53.05,25.21 52.82,25.43 50.81,25.43 ID0.P$1
ID2
  Top 0.2: ID2.P$1 50.14,27.94 52.67,27.94 53.91,26.71 U1.68
KEY-DOWN
  Top 0.2: R4.2 82.18,53.26 86.73,53.26 86.73,56.28 87.92,57.47 130.63,57.47 130.94,57.15 130.94,28.59
  Top 0.305: 130.94,28.59 CN7.4
KEY-EXT1
  Bottom 0.305: K1.P$1 102.52,36.51 R39.2
KEY-EXT2
  Bottom 0.305: R9.2 K2.P$1
KEY-EXT3
  Bottom 0.305: K3.P$1 106.33,36.51 R1.2
KEY-L
  Top 0.203: KEY_LEFT.P$1 R6.2
KEY-R
  Top 0.203: KEY_RIGHT.P$1 R5.2
KEY-UP
  Top 0.2: R8.2 80.83,58.1 80.93,58.1 81.25,58.42 86.48,58.42 86.8,58.1 131.41,58.1 131.41,26.59
  Top 0.305: CN7.3 131.41,26.59
L-A0  (via drill 0.35)
  Top 0.203: TO_LCD.28 CONTROLLER.3 99.67,32.69 v99.67,32.07
  Bottom 0.203: R40.2 98.39,32.07 v99.67,32.07
L-D0
  Top 0.203: CONTROLLER.6 TO_LCD.25
L-D1
  Top 0.203: CONTROLLER.7 TO_LCD.24
L-D2  (via drill 0.35)
  Top 0.203: TO_LCD.23 CONTROLLER.8 99.67,30.19 v99.67,30.48
  Bottom 0.203: R39.1 102.52,33.34 v99.67,30.48
L-D3
  Top 0.203: CONTROLLER.9 TO_LCD.22
L-D4
  Top 0.203: CONTROLLER.10 TO_LCD.21
L-D5
  Top 0.203: CONTROLLER.11 TO_LCD.20
L-D6  (via drill 0.35)
  Top 0.203: TO_LCD.19 CONTROLLER.12 98.39,28.19 v98.39,29.84
  Bottom 0.203: R9.1 104.43,33.34 100.94,29.84 v98.39,29.84
L-D7  (via drill 0.35)
  Top 0.203: CONTROLLER.13 TO_LCD.18 | TO_LCD.18 | v108.56,31.11 108.56,27.94 108.31,27.69 TO_LCD.18
  Bottom 0.203: R1.1 108.56,32.49 v108.56,31.11
L-RD/E
  Top 0.203: CONTROLLER.5 TO_LCD.26
L-RES
  Top 0.203: CONTROLLER.2 TO_LCD.29
L_GND  (via drill 0.35)
  Top 0.203: CONTROLLER.15 TO_LCD.16 | 109.51,33.66 109.51,33.69 | CONTROLLER.1 100.3,33.69 | 100.3,33.69 99.67,33.69 v99.67,33.66 | 100.3,33.69 TO_LCD.30 | TO_LCD.27 105.38,32.19
  Top 0.305: CONTROLLER.4 105.38,32.19 109.51,32.19 | 109.51,33.69 TO_LCD.30 | 109.51,32.19 109.51,33.66 | TO_LCD.16 109.51,26.69 109.51,32.19
  Top 0.508: v110.46,33.66 109.51,33.66
  Bottom 0.203: v99.67,33.66 98.39,33.66 R40.1
  Bottom 0.508: v110.46,33.66 111.09,33.66 112.05,32.7 C5.2 C6.2 C4.2 C3.2 C2.2 C1.2 112.05,17.14 K_EXT6.P$1 104.75,15.88 K_EXT5.P$1 K_EXT4.P$1
L_VDD
  Top 0.203: CONTROLLER.14 TO_LCD.17 99.67,27.19 99.67,19.68 CONTROLLER.29 | TO_LCD.3
  Top 0.254: CONTROLLER.30 TO_LCD.1 109.19,19.19 109.19,19.69 | CONTROLLER.29 TO_LCD.2 109.19,19.69 | CONTROLLER.28 TO_LCD.3 | TO_LCD.3 109.06,20.19 109.19,20.07 109.19,19.69
LCD-A0
  Top 0.2: 58.78,46.88 59.1,47.19 59.1,47.62
  Top 0.203: U1.49 57.33,45.43 58.78,46.88 | CN11.28 59.52,52.18 59.1,51.76 59.1,47.62
LCD-D0  (via drill 0.3)
  Top 0.2: 69.82,36.2 69.82,42.26 67.37,42.26 67.33,42.3 66.48,42.3 66.01,42.77 66.01,47.94 65.38,48.58 65.31,48.58 v65.22,48.48 | 61.02,51.27 61.02,48.98 v60.61,48.58
  Top 0.203: 61.02,51.27 CN11.25 | 69.82,36.2 69.82,35.84 U1.25
  Bottom 0.2: v65.22,48.48 60.71,48.48 v60.61,48.58
LCD-D1
  Top 0.2: R8.1 77.44,56.52
  Top 0.203: U1.47 58.33,41.11 57.78,41.66 57.78,42.8 58.33,43.35 58.33,45.28 61.52,48.47 CN11.24 61.52,55.63 63.36,57.47 76.49,57.47 77.44,56.52
LCD-D2
  Top 0.2: 62.02,47.56 60.33,45.87 60.33,39.37
  Top 0.203: 62.02,47.56 CN11.23 | 60.33,39.37 U1.43
LCD-D3  (via drill 0.3)
  Top 0.2: v66.85,47.88 66.92,47.94 73.63,47.94 v73.95,48.26
  Top 0.203: CN11.22 62.52,46.04 | 62.52,46.04 62.52,44.27 61.83,43.58 U1.40 | v61.88,46.04 62.52,46.04 | R6.1 81.67,46.99 v81.25,46.99
  Bottom 0.2: v73.95,48.26 79.98,48.26
  Bottom 0.203: v66.85,47.88 66.35,47.38 66.35,46.69 65.56,45.9 62.02,45.9 v61.88,46.04 | 79.98,48.26 v81.25,46.99
LCD-D4  (via drill 0.3)
  Top 0.2: 63.02,41.99 62.52,42.49 v62.52,43.18 | v81.25,45.09 82.94,43.4 R5.1 | v66.71,44.27 67.17,44.27 67.58,44.69 69.19,44.69 71.81,47.31 v72.36,47.31
  Top 0.203: CN11.21 63.02,41.99 63.33,41.68 63.33,40.64 63.82,40.15 63.82,39.22 63.33,38.73 U1.37
  Bottom 0.2: v62.52,43.18 65.62,43.18 v66.71,44.27 | v72.36,47.31 79.03,47.31 v81.25,45.09
LCD-D5
  Top 0.2: 64.13,40.39 64.13,40.34 64.33,40.14 64.33,40.01 | 76.27,56.83 64.42,56.83 63.47,55.88 63.47,53.39 CN11.20
  Top 0.203: 64.13,40.39 64.13,41.74 63.42,42.45 63.42,47.54 63.52,47.63 CN11.20 | U1.35 64.33,40.01 | R4.1 78.5,54.61 76.27,56.83
LCD-D6
  Top 0.203: U1.32 65.83,39.96 65.72,40.07 65.72,40.57 65.83,40.69 65.83,40.86 64.02,42.67 64.02,46.35 63.78,46.59 63.78,47.39 64.02,47.63 CN11.19
LCD-D7
  Top 0.2: 67.33,39.72 67.33,40.81 66.9,41.25 66.04,41.25 64.52,42.77 64.52,43.81
  Top 0.203: U1.29 67.33,39.72 | CN11.18 64.52,47.63 64.13,47.24 64.13,46.74 64.52,46.35 64.52,43.81
LCD-RD/E
  Top 0.2: CN11.26 60.52,50.39 TP2.P$1
LCD-RES
  Top 0.2: U1.17 68.87,31.21 66.42,33.66 56.58,33.66 56.2,34.03 56.2,37.02 55.22,38 55.22,39.92 56.44,41.15 56.44,45.18 58.74,47.48 58.74,51.9 59.02,52.18 CN11.29
LCD_BL  (via drill 0.3)
  Top 0.2: U1.78 57.83,22.94 v58.07,23.18 | v57.12,28.57 57.12,29.84 v57.75,30.48 | R15.1 53.63,36.51 v53.31,36.2
  Bottom 0.2: v58.07,23.18 58.07,24.92 57.12,26.35 v57.12,28.57 | v57.75,30.48 57.75,31.11 53.31,35.56 v53.31,36.2
LEFT_SLIDE  (via drill 0.3)
  Top 0.2: U1.5 69.38,25.21 v68.87,25.72 | v52.67,33.02 52.34,33.36 51.05,33.36 50.15,34.26 46.35,34.26 44.74,35.87 44.74,40.75 32.5,52.99 17.47,52.99 16.48,53.98 CN4.4 | v66.96,25.72 66.69,25.99 66.39,25.99 65.76,26.62 64.78,26.62 64.73,26.57 60.61,26.57 60.55,26.64 59.05,26.64 v59.03,26.67
  Bottom 0.2: v52.67,33.02 53.34,32.42 56.2,29.82 58.42,29.82 59.03,29.21 v59.03,26.67 | v68.87,25.72 v66.96,25.72
  Bottom 0.203: C44.2 CN4.4
LHS  (via drill 0.3)
  Top 0.2: CN2.7 107.46,56.3 96.28,56.3 91.06,51.08 77.97,51.08 76.67,49.77 76.67,37.86 74.29,35.49 74.29,34.64 v74.27,34.61 | v72.36,31.62 72.36,31.71 U1.18
  Bottom 0.2: v72.36,31.62 73.17,32.43 73.17,33.19 74.27,34.29 v74.27,34.61
  Bottom 0.203: C47.2 109.06,56.09 CN2.7
LHT-L  (via drill 0.3)
  Top 0.2: CN2.4 101.81,55.95 96.42,55.95 91.2,50.73 78.12,50.73 77.02,49.63 77.02,37.68 74.9,35.56 v74.9,35.24 | U1.51 55.53,35.53 v55.53,36.83 | v66.01,33.02 v58.39,33.02
  Bottom 0.2: v74.9,35.24 74.9,32.04 73.88,31.02 68.01,31.02 v66.01,33.02 | v58.39,33.02 55.53,35.88 v55.53,36.83
LHT-R
  Top 0.2: U1.22 70.48,33.68 77.83,33.68 78.08,33.93 78.08,49.19 78.56,49.67 92.91,49.67 96.23,52.99 103.36,52.99 CN2.5
LVS  (via drill 0.3)
  Top 0.152: U1.20
  Top 0.2: U1.20 69.33,32.72 69.23,32.82 69.23,41.87 69.19,41.91 67.23,41.91 67.19,41.95 66.33,41.95 65.48,42.8 65.48,47.52 v65.38,47.62 | CN1.8 41.53,55.53 41.88,55.88 44.42,55.88 44.74,55.56 44.74,53.34 | v56.96,49.37 56.96,50.96 55.85,52.07
  Top 0.203: 55.85,52.07 46.01,52.07 44.74,53.34
  Bottom 0.2: v65.38,47.62 58.71,47.62 v56.96,49.37
  Bottom 0.203: C46.2 41.56,54.73 CN1.8
LVT-D  (via drill 0.3)
  Top 0.2: CN1.1 27.53,55.88 28.45,56.8 45.37,56.8 v45.37,56.52 | v55.22,41.27 55.74,41.8 55.74,45.84 57.69,47.78 57.69,50.87 55.89,52.67 52.08,52.67 v50.77,53.98 | U1.34 64.83,40.86 v64.74,40.96
  Bottom 0.2: v64.74,40.96 64.42,41.27 v55.22,41.27 | v45.37,56.52 45.37,53.74 50.54,53.74 v50.77,53.98
LVT-U
  Top 0.2: U1.54 51.2,33.71 50.29,34.61 46.68,34.61 45.09,36.2 45.09,40.89 32.18,53.8
  Top 0.203: 32.18,53.8 CN1.3
MIX_SW  (via drill 0.3)
  Top 0.2: U1.99 68.33,20.12 68.52,19.94 68.52,14.35 v68.67,14.19 | v53.77,14.66 52.25,16.19 47.13,16.19 45.12,14.18 45.12,10.5 41.86,7.24 29.29,7.24 28.69,6.63 19.51,6.63 18.42,7.72 15.19,7.72 4.43,18.48 CN8.1
  Bottom 0.2: v68.67,14.19 68.2,14.66 v53.77,14.66
N$1
  Top 0.203: C16.1 14.6,17.57 16.7,17.57
  Top 0.305: R30.1 16.7,17.57 R10.2 16.7,14.47 U3.1
N$2
  Top 0.2: R16.2 U_V+.P$1 64.4,10.77 X2.1_VBUS
N$3  (via drill 0.35)
  Top 0.203: TO_LCD.5 105.38,21.19 v105.38,20.95
  Bottom 0.203: v105.38,20.95 105.38,19.05 C1.1
N$4  (via drill 0.35)
  Top 0.203: TO_LCD.6 104.42,21.69 v104.42,20.95
  Bottom 0.203: C2.1 108.56,21.27 108.56,21.69 104.42,21.69 v104.42,20.95
N$5  (via drill 0.35)
  Top 0.203: TO_LCD.7 107.89,22.19 108.56,22.86 v108.87,22.86
  Bottom 0.203: C3.1 109.51,22.86 v108.87,22.86
N$6  (via drill 0.35)
  Top 0.203: v105.38,22.86 105.55,22.69 TO_LCD.8
  Bottom 0.203: v105.38,22.86 106.86,22.86 109.72,25.72 C4.1
N$7  (via drill 0.35)
  Top 0.203: TO_LCD.9 107.92,23.19 108.86,24.13 111.09,24.13 111.09,32.07 v110.78,32.07
  Bottom 0.203: v110.78,32.07 110.14,31.43 C5.1
N$8  (via drill 0.5)
  other vias: 13.94,48.9
N$9  (via drill 0.35)
  Top 0.203: TO_LCD.10 104.65,23.69 104.65,22.86 v104.43,22.86
  Bottom 0.203: C7.1 102.52,20.95 v104.43,22.86
N$10  (via drill 0.35)
  Top 0.203: v103.16,22.86 103.47,23.71 103.95,24.19 TO_LCD.11
  Bottom 0.203: C7.2 98.72,22.86 v103.16,22.86
N$11  (via drill 0.35)
  Top 0.203: v104.11,25.4 104.11,25.19 TO_LCD.13
  Bottom 0.203: C8.2 98.72,26.04 | 98.72,26.04 C9.2 | v104.11,25.4 103.47,26.04 98.72,26.04
N$12  (via drill 0.35)
  Top 0.203: TO_LCD.12 103.16,24.69 v103.16,24.45
  Bottom 0.2: C8.1 101.57,24.45
  Bottom 0.203: 101.57,24.45 v103.16,24.45
N$13
  Top 0.2: P1.1 16.48,36.34 16.48,33.02 15.43,33.02 R18.1 R19.1
N$14  (via drill 0.35)
  Top 0.203: v105.38,26.04 105.38,25.69 TO_LCD.14
  Bottom 0.203: C9.1 100.61,27.3 105.38,27.3 v105.38,26.04
N$15  (via drill 0.35)
  Top 0.203: TO_LCD.15 110.46,26.19 v110.46,27.3
  Bottom 0.203: v110.46,27.3 110.46,28.58 C6.1
N$16
  Top 0.2: R19.2 11.4,28.16 11.4,26.84 T4.C
N$17
  Top 0.2: U_D+.P$1 64.42,12.7 64.42,13.97 66.33,13.97 66.33,11.11 66,10.79 X2.3_D+
  Top 0.203: R34.2 U_D+.P$1
N$18  (via drill 0.3)
  Top 0.203: R2.2 v17.75,3.17 R3.2 | C14.1 18.66,12.35 v18.38,12.06
  Bottom 0.203: v17.75,3.17 17.75,11.43 v18.38,12.06
N$19  (via drill 0.3)
  Top 0.2: R20.1 v50.14,20.32 | v50.14,17.14 46.96,17.14 44.42,14.61 44.42,10.79 41.56,7.94 23.78,7.94 23.61,8.11 23.61,10.79 13.3,10.79 10.77,13.34 10.77,24.77 11.72,25.72 T4.B
  Bottom 0.2: v50.14,20.32 v50.14,17.14
N$20
  Top 0.254: 45.69,50.16 R14.1 45.69,49.84
  Top 0.406: 45.69,50.16 47.91,50.16 BUZR.2 | 45.69,49.84 45.69,49.53 D2.C
N$21  (via drill 0.5)
  other vias: 15.84,48.9
N$22
  Top 0.2: U1.23 71.64,34.21 74.58,37.15 TP1.P$1
N$23  (via drill 0.3)
  Top 0.152: U1.31 66.33,35.87 v66.64,35.56
  Top 0.2: v70.77,36.2 70.45,36.51 70.45,40.7
  Top 0.203: 70.45,40.7 70.45,42.55 72.04,44.13 U2.6
  Bottom 0.2: v66.64,35.56 70.14,35.56 v70.77,36.2
N$24  (via drill 0.3)
  Top 0.152: U1.33 65.33,35.28 v65.38,35.24
  Top 0.2: 71.09,40.06 71.09,36.83 v71.72,36.2
  Top 0.203: 71.09,40.06 71.09,41.91 72.04,42.86 U2.5
  Bottom 0.2: v65.38,35.24 66.11,35.24 66.39,34.95 70.48,34.95 v71.72,36.2
N$25
  Top 0.2: U1.38 PA25.P$1
N$26  (via drill 0.3)
  Top 0.2: v61.56,44.45 61.33,44.22 U1.41 | U2.2 67.5,45.4 v67.19,45.72
  Bottom 0.2: v67.19,45.72 66.96,45.72 65.56,44.31 61.7,44.31 v61.56,44.45
N$27  (via drill 0.5)
  other vias: 17.75,48.9
N$28  (via drill 0.5)
  other vias: 13.94,46.99
N$30  (via drill 0.3)
  Top 0.2: U1.97 67.33,20.38 v67.28,20.32
  Bottom 0.2: C10.2 Q1.P$3 68.16,20.57 67.92,20.32 v67.28,20.32
N$31  (via drill 0.3)
  Top 0.2: U1.96 66.83,23.3 v65.69,24.45
  Bottom 0.2: C11.2 Q1.P$1 65.69,23.46 v65.69,24.45
N$32  (via drill 0.5)
  other vias: 17.75,46.99
N$34  (via drill 0.3)
  Top 0.2: R26.1 33.41,29 31.63,27.22 31.63,12.24 31.95,11.92 CN12.8 31.95,10.56 34.22,8.29 41.33,8.29 43.79,10.76 43.79,13.34 43.78,13.35 43.78,14.61 46.96,17.78 51.82,17.78 53.11,19.07 53.73,19.1 53.83,19 v55,19 | U1.81 59.33,19.36 v59.03,19.05
  Bottom 0.2: v59.03,19.05 55.05,19.05 v55,19
N$35  (via drill 0.3)
  Top 0.2: v59.03,23.18 59.03,22.86 60.33,22.86 U1.83 | 41.88,22.41 CN12.10 | R25.1 42.73,23.26 41.88,22.41 | v52.67,22.23 42.06,22.23 41.88,22.41
  Bottom 0.2: v59.03,23.18 59.03,22.23 v52.67,22.23
N$36  (via drill 0.3)
  Top 0.2: R32.1 32.35,25.61 32.35,13.97 33.05,13.27 CN12.7 32.88,11.44 32.88,10.65 34.63,8.89 41.11,8.89 43.12,10.9 43.12,14.84 46.69,18.41 v48.55,18.41 | v48.55,23.18 48.55,24.77 48.23,25.08 48.23,28.71 48.23,29.21 48.87,29.84 52.67,29.84 53.81,28.71 U1.64
  Bottom 0.2: v48.55,23.18 v48.55,18.41
N$37  (via drill 0.3)
  Top 0.2: CN12.5 35.25,10.43 35.87,9.81 40.14,9.81 40.6,10.28 40.6,13.02 46.63,19.05 v47.59,19.05 | U1.63 53.94,29.21 52.67,30.48 48.23,30.48 47.59,29.84 v47.59,23.18
  Bottom 0.2: v47.59,19.05 v47.59,23.18
N$38  (via drill 0.3)
  Top 0.2: R13.1 67.78,40.85 67.04,41.6 66.19,41.6 65.13,42.66 65.13,46.6 v64.74,46.99
  Top 0.203: v56.17,48.26 56.17,48.58 55.68,48.58 T2.B
  Bottom 0.2: v64.74,46.99 58.53,46.99 57.26,48.26 v56.17,48.26
N$40  (via drill 0.3)
  Top 0.2: CN12.2 38.55,22.07 38.92,22.44 R37.1 38.92,24.99 40.69,26.76 40.69,29.77 v40.61,29.84 | U1.57 53.77,32.21 53.31,31.75 v40.61,31.75
  Bottom 0.2: v40.61,31.75 v40.61,29.84
N$41  (via drill 0.3)
  Top 0.2: CN12.1 v39.65,13.01 v39.66,13.02 46.33,19.68 51.41,19.68 51.42,19.7 53.3,19.7 58.42,24.82 58.42,25.4 v61.56,25.4 | R38.1 33.41,15.46 v35.53,13.34
  Top 0.254: U1.39 62.33,35.38 v62.2,35.24
  Bottom 0.2: v61.56,25.4 60.93,26.04 60.93,33.66 62.2,34.92 v62.2,35.24 | v35.53,13.34 39.34,13.34 v39.66,13.02
N$42
  Top 0.305: SPKR.2 22.42,20.27 U3.5
N$43
  Top 0.254: 53.31,49.85 T2.C
  Top 0.406: D2.A 53.31,49.85 | T2.C BUZR.1
N$45
  Top 0.2: T3.B 54.41,42.27 R15.2
N$46
  Top 0.406: LCD_BL.2 50.94,40.47 50.94,43.5 T3.C
N$47
  Top 0.406: R17.1 48.55,42.55 LCD_BL.1
N$57  (via drill 0.3)
  Top 0.203: R29.2 127.71,45.11 C12.1 120.62,40.01 120.62,12.06 77.44,12.06 77.44,19.05 C40.1 | U1.1 70.74,23.21 v72.36,21.59
  Top 0.254: C40.1 76.17,19.05 v76.17,21.59
  Bottom 0.203: v72.36,21.59 v76.17,21.59
N$58
  Top 0.2: 38.81,26.56 38.07,25.82 38.07,22.94 37.45,22.32 CN12.3 | 38.81,26.56 R36.1 | 38.81,26.56 39.03,26.56 39.98,27.51 39.98,30.72 40.85,30.72 41.34,31.21 U1.59
N$59
  Top 0.305: SPKR.1 21.16,21.54 U3.6
N$61
  Top 0.2: 21.23,14.39 U3.3
  Top 0.203: C14.2 21.27,14.35 21.23,14.39
N$62
  Top 0.305: C15.2 24.1,13.97 22.92,13.97 U3.4
PPM1  (via drill 0.3)
  Top 0.2: U1.12 67.11,28.71 66.64,29.18 59.05,29.18 59.03,29.21 v57.75,29.21 | v46.96,14.61 45.83,13.47 45.83,10.21 41.97,6.35 29.68,6.35 29.26,5.93 14,5.93 8.23,11.7 v8.23,13.34 | v46.25,23.25 46.25,23.42 46.96,24.13 46.96,29.84 47.95,30.83 52.82,30.83 52.86,30.8 53.63,30.8 v53.63,30.48 | v8.23,16.51 8.23,23.86 7.61,24.48 CN8.4
  Bottom 0.2: v57.75,29.21 54.9,29.21 v53.63,30.48 | v46.96,14.61 46.25,15.31 v46.25,23.25 | v8.23,13.34 v8.23,16.51
PPM2
  Top 0.2: U1.19 71.55,32.21 71.72,32.38 73.82,32.38 PPM2.P$1
PWR_SW_CTR_A&B
  Top 0.2: R18.2 12.45,32.38 11.18,33.66 D3.C
  Top 0.457: P1.2 10.86,36.66
  Top 0.508: F1.2 10.86,30.42 D3.C 10.86,36.66 10.86,50.07 10.13,50.8 4.06,50.8 CN9.4
PWRSW_OFF_A&B  (via drill 0.5)
  Top 0.508: v8.23,49.53 D4.C
  Bottom 0.508: CN9.5 6.5,53.16 8.23,51.44 v8.23,49.53
PWRSW_ON_A  (via drill 0.3, 0.35)
  Top 0.2: v53.94,13.34 51.44,15.84 47.28,15.84 45.48,14.03 45.48,10.36 42,6.88 29.71,6.88 29.11,6.28 19.36,6.28 18.87,6.77 R35.1 14.79,6.77 v9.5,12.06 | CN8.5 8.51,26.48 9.5,25.5 v9.5,15.24 | 74.27,18.41 70.45,18.41 v70.45,13.34
  Top 0.203: R12.2 74.27,18.41
  Top 0.457: CN8.5 3.34,26.48 1.88,27.94 1.88,47.62 3.41,49.16 CN9.3
  Bottom 0.2: v9.5,15.24 v9.5,12.06
  Bottom 0.203: v70.45,13.34 v53.94,13.34
PWRSW_ON_B  (via drill 0.5)
  Top 0.508: C17.+ 9.48,42.53 v9.5,42.55 | v12.04,38.73 13.23,38.73 IC1.1
  Top 0.61: v12.67,34.92 13.14,34.46 P1.3
  Top 0.813: IC3.1 13.3,38.81 13.23,38.73
  Bottom 0.508: v9.5,42.55 10.77,42.55 | 10.59,47.16 10.77,46.99 10.77,42.55 | 10.77,42.55 10.77,39.37 11.4,38.73 v12.04,38.73
  Bottom 0.61: CN9.2 10.59,47.16 | v12.67,34.92 12.04,35.56 v12.04,38.73
RF_PWR_DET  (via drill 0.3)
  Top 0.2: U1.75 55.22,22.57 v53.31,20.67 | D1.3 18.55,8.09 19.66,6.99 28.55,6.99 29.15,7.59 41.71,7.59 44.77,10.65 44.77,14.32 46.99,16.54 52.35,16.54 53.31,17.5 v53.31,18.41
  Top 0.203: R35.2 16.27,8.89 D1.3
  Bottom 0.203: v53.31,18.41 v53.31,20.67
RFMOD_+6V_CTRL
  Top 0.203: CN8.3 5.52,22.48 RF-6V.P$1
RHS  (via drill 0.3)
  Top 0.2: U1.14 59.48,29.71 v58.71,30.48 | CN1.7 39.42,54.7 38.07,53.34 38.07,49.41 46.15,41.33 46.15,37.64 46.33,37.47 v52.67,37.47
  Bottom 0.2: v58.71,30.48 58.71,30.8 54.26,35.24 54.26,36.51 53.94,36.83 53.31,36.83 v52.67,37.47
  Bottom 0.203: C45.2 39.66,54.82 CN1.7
RHT-L  (via drill 0.3)
  Top 0.2: U1.74 53.09,23.71 v52.04,24.77 | v49.5,35.56 49.46,35.6 46.33,35.6 45.45,36.48 45.45,41.04 33.53,52.95 CN1.4
  Bottom 0.2: v49.5,35.56 49.5,35.24 51.72,33.02 51.72,32.7 52.04,32.38 v52.04,24.77
RHT-R  (via drill 0.3)
  Top 0.2: U1.62 56.35,29.71 56.35,30.66 v56.8,31.11 | v52.04,36.83 45.8,36.83 45.8,41.18 35.53,51.45 CN1.5
  Bottom 0.2: v56.8,31.11 56.8,31.25 52.36,35.7 52.36,36.83 v52.04,36.83
RIGHT_SLIDE
  Top 0.2: U1.24 71.36,34.71 73.8,37.15 73.8,37.79 75.96,39.95 75.96,50.07 77.68,51.79 85.88,51.79 87.21,53.12 87.21,55.65 88.31,56.74 123.16,56.74 123.81,56.08 123.81,54.72 CN5.4
  Bottom 0.203: C50.2 CN5.4
ROT_A  (via drill 0.3)
  Top 0.2: U1.84 60.83,20.23 60.3,19.68 60.3,11.43 59.94,11.07 59.94,7.67 58.26,6 51.28,6 50.57,5.29 42.91,5.29 42.34,4.73 30.05,4.73 29.84,4.52 12.11,4.52
  Top 0.305: 12.11,4.52 8.79,4.52 v8.23,5.08 | v8.23,7.62 4.28,7.62 CN6.2
  Bottom 0.305: v8.23,7.62 v8.23,5.08
ROT_B  (via drill 0.3)
  Top 0.2: v55.15,7.05 55.15,6.99 51.27,6.99 50.28,6 42.61,6 42.26,5.64 29.97,5.64 29.55,5.22 13.71,5.22 9.4,9.53 8.23,9.53 | v59.03,7.62 58.24,8.4 58.24,16.16 58.04,16.36 58.04,17.57 58.39,17.93 58.39,19.64 58.83,20.09 U1.80
  Top 0.305: 8.23,9.53 4.18,9.53 CN6.3
  Bottom 0.2: v59.03,7.62 58.39,6.99 55.22,6.99 v55.15,7.05
ROT_PUSH
  Top 0.2: U1.79 58.33,20.08 57.69,19.43 57.69,16.22 57.75,16.15 57.75,7.98 56.12,6.35 51.13,6.35 50.43,5.64 42.76,5.64 42.19,5.08 29.9,5.08 29.69,4.87 13.56,4.87 11.83,6.6 5.26,6.6 CN6.1
RVS  (via drill 0.3)
  Top 0.2: U1.6 74.05,25.71 74.5,25.25 76.66,25.25 79.03,27.62 v79.03,29.53 | CN2.8 111.06,52.74 110.46,52.14 95.92,52.14 93.11,49.32 78.91,49.32 78.45,48.86 78.45,32.76 76.97,31.28 v77.12,31.28
  Bottom 0.2: v77.12,31.28 78.87,29.53 v79.03,29.53
  Bottom 0.203: C48.2 111.06,56.24 CN2.8
RVT-D  (via drill 0.3)
  Top 0.2: U1.72 56.43,24.71 56.49,24.77 56.49,25.03 58.76,27.3 59.89,27.3 60.04,27.15 61.56,27.15 61.78,26.93 62.62,26.93 62.84,27.15 63.86,27.15 64.08,26.92 64.59,26.92 64.81,27.15 66.09,27.15 v66.64,26.59 | CN2.2 97.71,53.34 96.08,53.34 92.77,50.02 78.41,50.02 77.72,49.34 77.72,36.61 76.17,35.06 v76.17,35.24
  Bottom 0.2: v76.17,35.24 76.17,31.75 72.21,27.79 68.5,27.79 v66.64,26.59
RVT-U  (via drill 0.3)
  Top 0.2: v66.39,28.57 58.12,28.57 57.48,27.94 56.48,27.94 56.22,28.21 U1.65 | v75.53,34.61 75.53,35.56 77.37,37.4 77.37,49.48 78.27,50.38 92.05,50.38 96.36,54.7 CN2.1
  Bottom 0.2: v66.39,28.57 66.71,28.26 72.04,28.26 75.53,31.75 v75.53,34.61
RX1
  Top 0.2: U1.53 51.8,34.21 RX1.P$1
RX2
  Top 0.2: RX2.P$1 58.83,42.1 U1.46
RX3
  Top 0.2: RX3.P$1 75.68,26.21 U1.7
SCL
  Top 0.2: R28.1 36.41,38.98 RTC.3 36.16,34.29 38.04,32.41 53.24,32.41 54.04,33.21 U1.55
SDA  (via drill 0.3)
  Top 0.2: v50.45,33.02 40.61,33.02 38.7,34.92 RTC.2 39.59,39.62 R27.1 | U1.66 54.17,27.71 52.67,29.21 v51.09,29.21
  Bottom 0.2: v50.45,33.02 51.09,32.38 v51.09,29.21
SOFT_PWR_OFF  (via drill 0.3)
  Top 0.2: U1.48 57.83,35.48 v58.07,35.24 | R20.2 52.57,23.07 v52.67,23.18 | v57.12,24.77 58.39,26.04 v60.3,26.04
  Bottom 0.2: v58.07,35.24 58.07,34.24 60.3,32.02 v60.3,26.04 | v57.12,24.77 57.12,24.13 56.17,23.18 v52.67,23.18
THR_CUT
  Top 0.2: U1.82 59.83,17.64 THR_CUT.P$1
THR_TRIM_POT  (via drill 0.3)
  Top 0.2: U1.21 72.17,33.21 v72.36,33.02 | CN3.2 87.12,51.44 77.83,51.44 76.31,49.92 76.31,38.01 73.66,35.36 73.66,35.27 v73.63,35.24
  Bottom 0.2: v73.63,35.24 72.36,33.97 v72.36,33.02
  Bottom 0.203: C42.2 90.41,55.91 CN3.2
TRN_BTN  (via drill 0.3)
  Top 0.2: v73.06,30.35 78.08,30.35 79.16,31.43 79.16,48.57 79.2,48.62 93.4,48.62 96.22,51.44 116.59,51.44 116.59,51.49 CN5.2 | U1.58 56.54,31.71 56.55,31.72 65.98,31.72 v66.01,31.75
  Bottom 0.2: v73.06,30.35 67.41,30.35 v66.01,31.75
TRN_PPM_IN
  Top 0.2: T_PPM_I.P$1 62.83,23.32 63.83,22.32 U1.90
TRN_PPM_OUT
  Top 0.2: U1.86 61.83,19.95 T_PPM_O.P$1
TX1
  Top 0.2: U1.52 52.57,34.71 TX1.P$1
TX2
  Top 0.2: TX2.P$1 59.34,43.5 59.83,43.01 U1.44
TX3
  Top 0.2: U1.9 72.9,27.21 TX3.P$1
USB-D+
  Top 0.152: U1.89 63.33,19.05 63.24,18.95 63.24,15.05 R34.1
USB-D-
  Top 0.152: U1.88 62.83,16.09 R33.1
USB_D-
  Top 0.2: R33.2 U_D-.P$1 61.88,11.75 63.47,10.16 63.47,6.99 65.2,6.99 X2.2_D-
USB_PWR-DET
  Top 0.152: R31.2 R16.1 65.96,15.4 65.96,20.24 65.83,20.36 U1.94
VBAT
  Top 0.508: F1.1 5.84,29.84 4.47,28.48 CN8.6
VBAT_MEAS
  Top 0.2: U1.3 77.44,24.21 R11.2 79.32,22.44 C13.2
  Top 0.203: R11.2 R12.1
XX_FLAP_TRM-3W
  Top 0.2: CN5.6 128.24,54.25 TP4.P$1

## Text on the board
tPlace: Bottom Pins | BOTTOM | TOP PINS | GND | AR-uni-MKII / Versoion 1.0
tNames: Layer 150 has external wiring connections
Notes: AUX2_SW-3WAY -A | AUX4_SW | AIL_DR_SW | LEFT_SLIDER | ANA_GND | AUX_TRM-3WAY | +3V_ANA | LVT-D | ANA_GND | LVT-U | RHT-L | RHT-R | ANA_GND | RHS | LVS | +3V_ANA | ANA_GND | THR_TRIM_POT | +3V_ANA | RVT-U | RVT-D | ANA_GND | LHT-L | LHT-R | ANA_GND | LHS | RVS | +3V_ANA | FLAP-SW-3WAY | TRN_BTN | ELEV_DR | RIGHT_SLIDE | ANA_GND | XX_FLAP_TRM-3W | +3V_ANA | A_GND | PWR_SW_OFF_A&B | PWR_SW_BAT | RF_MOD_PWR | PWR_SW_ON_B | BEEPER_NC | GND | TRN3 | TRN2 | CHARGER+ | TRN1 | GND | BTN_EXIT | VBAT+ | KEY-DOWN | RF_MODULE_PWR | KEY-UP | PPM1 | BTN_MENU | RFMOD_+6V_CTRL | GND | GEAR_SW | MIX_SW | GND | ROT_B | ROT_A | ROT_PUSH